# EasyEDA Pro project 滤波电路与主级放大.eprj

# Schematic Schematic1
Board Name: 滤波电路; Create Date: 2024-09-16
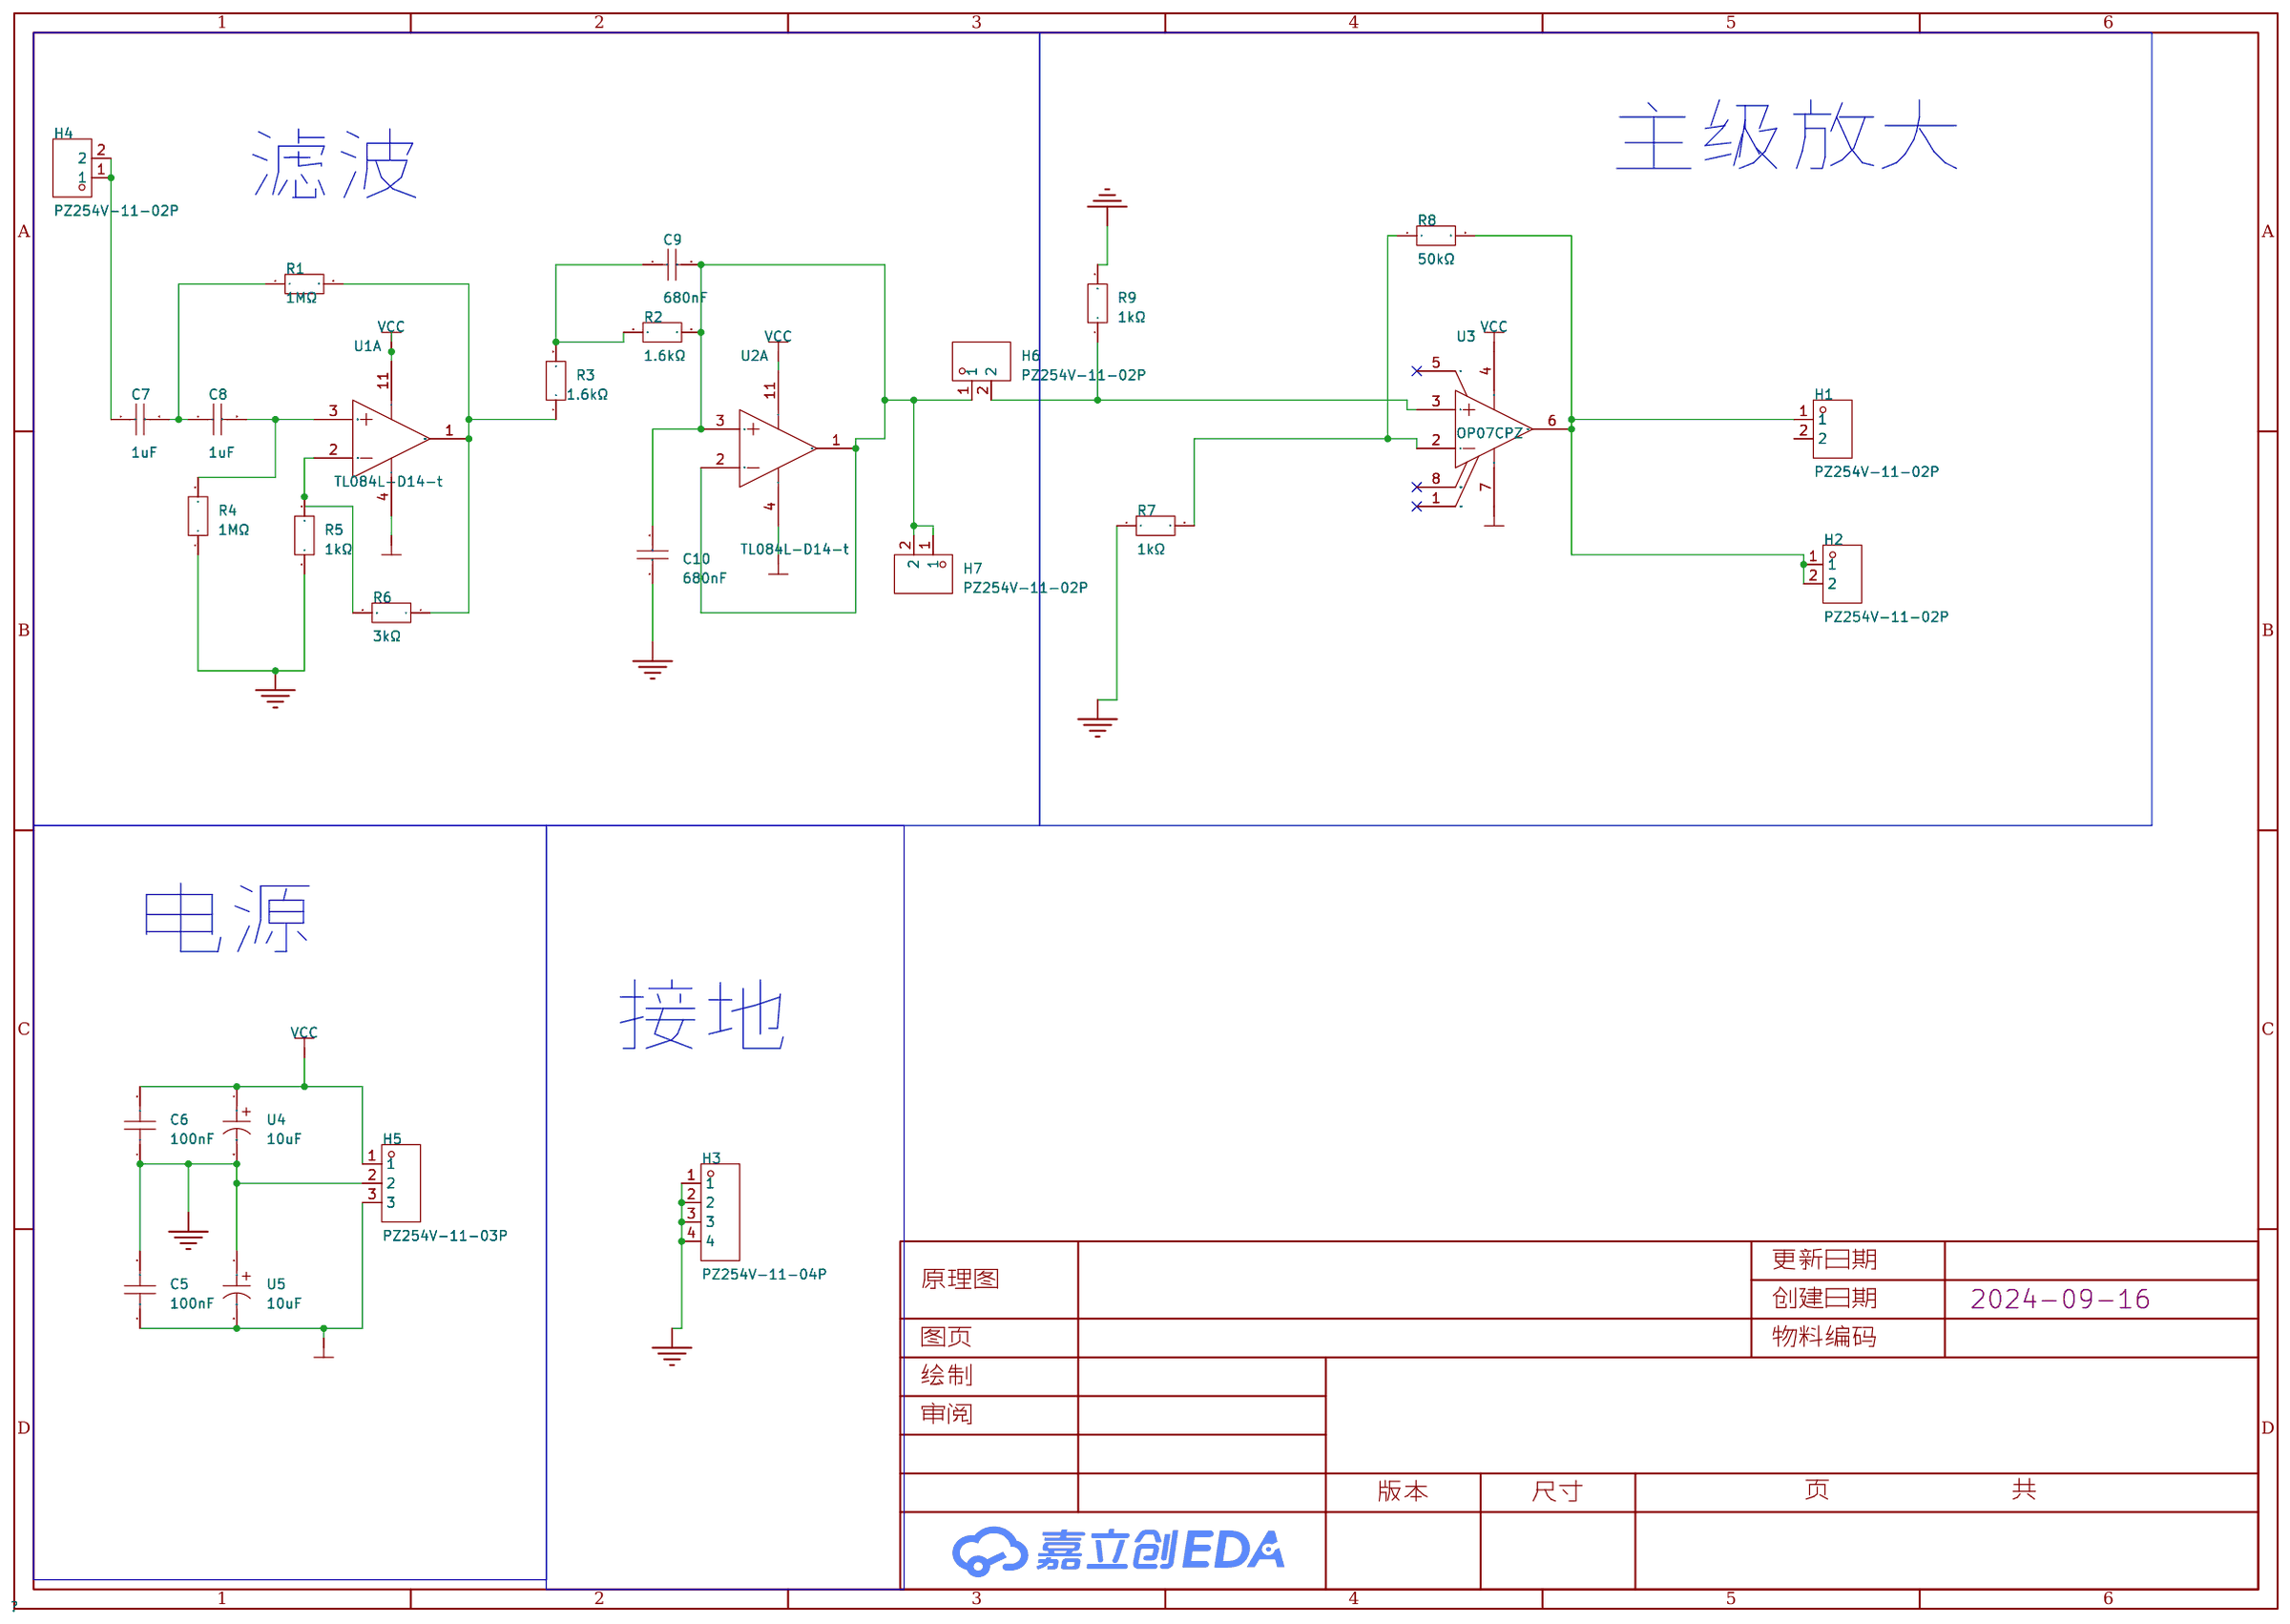
[diagram p0: schematic sheet]

## Parts
C5  100nF  [CAP-TH_L8.5-W5.0-P5.00-D1.2]
C6  100nF  [CAP-TH_L8.5-W5.0-P5.00-D1.2]
C7  1uF  [CAP-TH_L7.5-W6.5-P5.00-D0.5]
C8  1uF  [CAP-TH_L7.5-W6.5-P5.00-D0.5]
C9  680nF  [CAP-TH_L7.5-W6.5-P5.00-D0.5]
C10  680nF  [CAP-TH_L7.5-W6.5-P5.00-D0.5]
H1  PZ254V-11-02P  [HDR-TH_2P-P2.54-V-M]
H2  PZ254V-11-02P  [HDR-TH_2P-P2.54-V-M]
H3  PZ254V-11-04P  [HDR-TH_4P-P2.54-V-M]
H4  PZ254V-11-02P  [HDR-TH_2P-P2.54-V-M]
H5  PZ254V-11-03P  [HDR-TH_3P-P2.54-V-M]
H6  PZ254V-11-02P  [HDR-TH_2P-P2.54-V-M]
H7  PZ254V-11-02P  [HDR-TH_2P-P2.54-V-M]
R1  1MΩ  [RES-TH_BD2.4-L6.3-P10.30-D0.6]
R2  1.6kΩ  [RES-TH_BD2.4-L6.3-P10.30-D0.6]
R3  1.6kΩ  [RES-TH_BD2.4-L6.3-P10.30-D0.6]
R4  1MΩ  [RES-TH_BD2.4-L6.3-P10.30-D0.6]
R5  1kΩ  [RES-TH_BD2.4-L6.3-P10.30-D0.6]
R6  3kΩ  [RES-TH_BD2.4-L6.3-P10.30-D0.6]
R7  1kΩ  [RES-TH_BD2.4-L6.3-P10.30-D0.6]
R8  50kΩ  [RES-TH_BD2.4-L6.3-P10.30-D0.6]
R9  1kΩ  [RES-TH_BD2.4-L6.3-P10.30-D0.6]
U1  TL084L-D14-t  [PDIP-14_L19.3-W6.5-P2.54-LS7.6-BL]  (section 1)
U2  TL084L-D14-t  [PDIP-14_L19.3-W6.5-P2.54-LS7.6-BL]  (section 1)
U3  OP07CPZ  [PDIP-8_L9.3-W6.4-P2.54-LS7.6-BL]
U4  10uF  [CAP-TH_BD6.3-P2.50-D0.5-FD]
U5  10uF  [CAP-TH_BD6.3-P2.50-D0.5-FD]

## Library data of the parts
C5 C6 = CT4-0805B104K500F3: LCSC Part Name: 100nF ±10% 50V C3型（直脚）; Supplier Part: C84772; Manufacturer: FH(风华); Supplier Footprint: 插件,P=5.08mm; JLCPCB Part Class: 扩展库; Datasheet: https://atta.szlcsc.com/upload/public/pdf/source/20190402/C385200_059806A6312B28FF1421A2413EB641E1.pdf; Supplier: LCSC; Tolerance: ±10%; Voltage Rated: 50V; Temperature Coefficient: X7R
C7-C10 = PE684J2A0502: LCSC Part Name: 680nF ±5% 100V; Supplier Part: C478437; Manufacturer: KYET(科雅); Supplier Footprint: 插件,P=5mm; JLCPCB Part Class: 扩展库; Datasheet: https://atta.szlcsc.com/upload/public/pdf/source/20200102/C478437_80764A5A52068CAA3BEDED5BEA089104.pdf; Supplier: LCSC; Tolerance: ±5%; Voltage Rated: 100V; Operating Temperature: -40℃~+110℃
H1 H2 H4 H6 H7 = PZ254V-11-02P: LCSC Part Name: 间距:2.54mm 1x2P 直插 方针; Supplier Part: C492401; Manufacturer: XFCN(兴飞); Supplier Footprint: 插件,P=2.54mm; JLCPCB Part Class: 扩展库; Datasheet: https://atta.szlcsc.com/upload/public/pdf/source/20200309/C492401_A812433581A9B211A7FFA413ADDFF0E5.pdf; Supplier: LCSC; Pin Structure: 1x2P; Pitch: 2.54mm; Circluar Pins/Square Pins: 方针; Mounting Type: 直插; Number of Rows: 单排; Number of Pins: 2P; Length of Mating Pin: 6mm; Insulation Height: 2.5mm; Length of End Connection Pin: 3mm; Contact Material: 黄铜; Operating Temperature Range: -40℃~+105℃; Color: 黑色
H3 = PZ254V-11-04P: LCSC Part Name: 间距:2.54mm 1x4P 直插 方针; Supplier Part: C2691448; Manufacturer: XFCN(兴飞); Supplier Footprint: 插件,P=2.54mm; JLCPCB Part Class: 扩展库; Datasheet: https://atta.szlcsc.com/upload/public/pdf/source/20200309/C492403_F9F19131791D08044AD4F84F8E751A34.pdf; Supplier: LCSC; Pin Structure: 1x4P; Pitch: 2.54mm; Circluar Pins/Square Pins: 方针; Mounting Type: 直插; Number of Rows: 单排; Number of Pins: 4P; Current Rating (Max): 3A; Voltage Rating (Max): 250V; Length of Mating Pin: 6mm; Insulation Height: 2.5mm; Length of End Connection Pin: 3mm; Operating Temperature Range: -40℃~+105℃; Color: 黑色
H5 = PZ254V-11-03P: LCSC Part Name: 间距:2.54mm 1x3P 直插 方针; Supplier Part: C2937625; Manufacturer: XFCN(兴飞); Supplier Footprint: 插件,P=2.54mm; JLCPCB Part Class: 扩展库; Datasheet: https://atta.szlcsc.com/upload/public/pdf/source/20200309/C492402_8335C3D49C4E4C618838D59BB1D024C1.pdf; Supplier: LCSC; Pin Structure: 1x3P; Pitch: 2.54mm; Circluar Pins/Square Pins: 方针; Mounting Type: 直插; Number of Rows: 单排; Number of Pins: 3P; Current Rating (Max): 3A; Voltage Rating (Max): 250V; Length of Mating Pin: 6mm; Insulation Height: 2.5mm; Length of End Connection Pin: 3mm; Operating Temperature Range: -40℃~+105℃; Color: 黑色
R1-R9 = RN1/4W10KFT/BA1: LCSC Part Name: 10kΩ ±1% 250mW 金属膜电阻; Supplier Part: C410695; Manufacturer: Tyohm(幸亚电阻); Supplier Footprint: 插件,D2.4xL6.5mm; JLCPCB Part Class: 扩展库; Datasheet: https://atta.szlcsc.com/upload/public/pdf/source/20190808/C410699_D126E64D28B638F1D73B58E9F61DFD9B.pdf; Supplier: LCSC; Type: 金属膜电阻; Tolerance: ±1%; Overload Voltage (Max): 250V; Power(Watts): 250mW; Temperature Coefficient: ±50ppm/℃; Operating Temperature Range: -55℃~+125℃
U1 U2 = TL084L-D14-t: Supplier Part: C7509603; Manufacturer: UTC(友顺); Supplier Footprint: DIP-14; JLCPCB Part Class: 扩展库; Datasheet: https://atta.szlcsc.com/upload/public/pdf/source/20230825/21103CE5C41335A2FDBC1DDE797A8A69.pdf; Supplier: LCSC
U3 = OP07CPZ: Supplier Part: C408829; Manufacturer: ADI(亚德诺); Supplier Footprint: PDIP-8; JLCPCB Part Class: 扩展库; Datasheet: https://atta.szlcsc.com/upload/public/pdf/source/20190807/C408829_BE0F3A08CC30F779D7ED20D5AC7364F9.pdf; Supplier: LCSC
U4 U5 = UPM2A100MED1TD: LCSC Part Name: 10uF ±20% 100V; Supplier Part: C1580893; Manufacturer: Nichicon(尼吉康); Supplier Footprint: 插件; JLCPCB Part Class: 扩展库; Datasheet: https://atta.szlcsc.com/upload/public/pdf/source/20211202/F7FDECE0DC1B59C562DF08691C7E54B2.pdf; Supplier: LCSC; Tolerance: ±20%; Rated Voltage: 100V; Ripple Current: 104mA@10kHz; Lead Spacing: 2.5mm; φD: 6.3mm; Lifetime @ Temp: 2000hrs@105℃; Operating Temperature: -55℃~+105℃

## Nets
GND: C5.2 C6.1 C10.1 H3.1 H3.2 H3.3 H3.4 H5.2 R4.1 R5.1 R7.1 R9.2 U4.2 U5.1
VCC: C6.2 H5.1 U1.11(V-) U2.11(V-) U3.4(V-) U4.1
VDD: C5.1 H5.3 U1.4(V+) U2.4(V+) U3.7(V+) U5.2
$1N1947: C7.1 H4.1 H4.2
$1N1973: C7.2 C8.1 R1.1
$1N1977: C8.2 R4.2 U1.3(IN1+)
$1N2032: R5.2 R6.2 U1.2(IN1-)
$1N2064: R1.2 R3.1 R6.1 U1.1(OUT1)
$1N2160: C9.1 R2.1 R3.2
$1N2352: R7.2 R8.1 U3.2(IN-)
$1N2380: H1.1 H2.1 H2.2 R8.2 U3.6(OUT)
$1N3767: H6.2 R9.1 U3.3(IN+)
$1N3780: C9.2 C10.2 H6.1 H7.1 H7.2 R2.2 U2.1(OUT1) U2.2(IN1-) U2.3(IN1+)

Not connected (* = marked no-connect by the designer): H1 2; U3 1(VOS_TRIM)* 5(NC)* 8(VOS_TRIM)*

## Notes on the sheet
- 主级放大
- 滤波
- 电源
- 接地

# Board PCB1
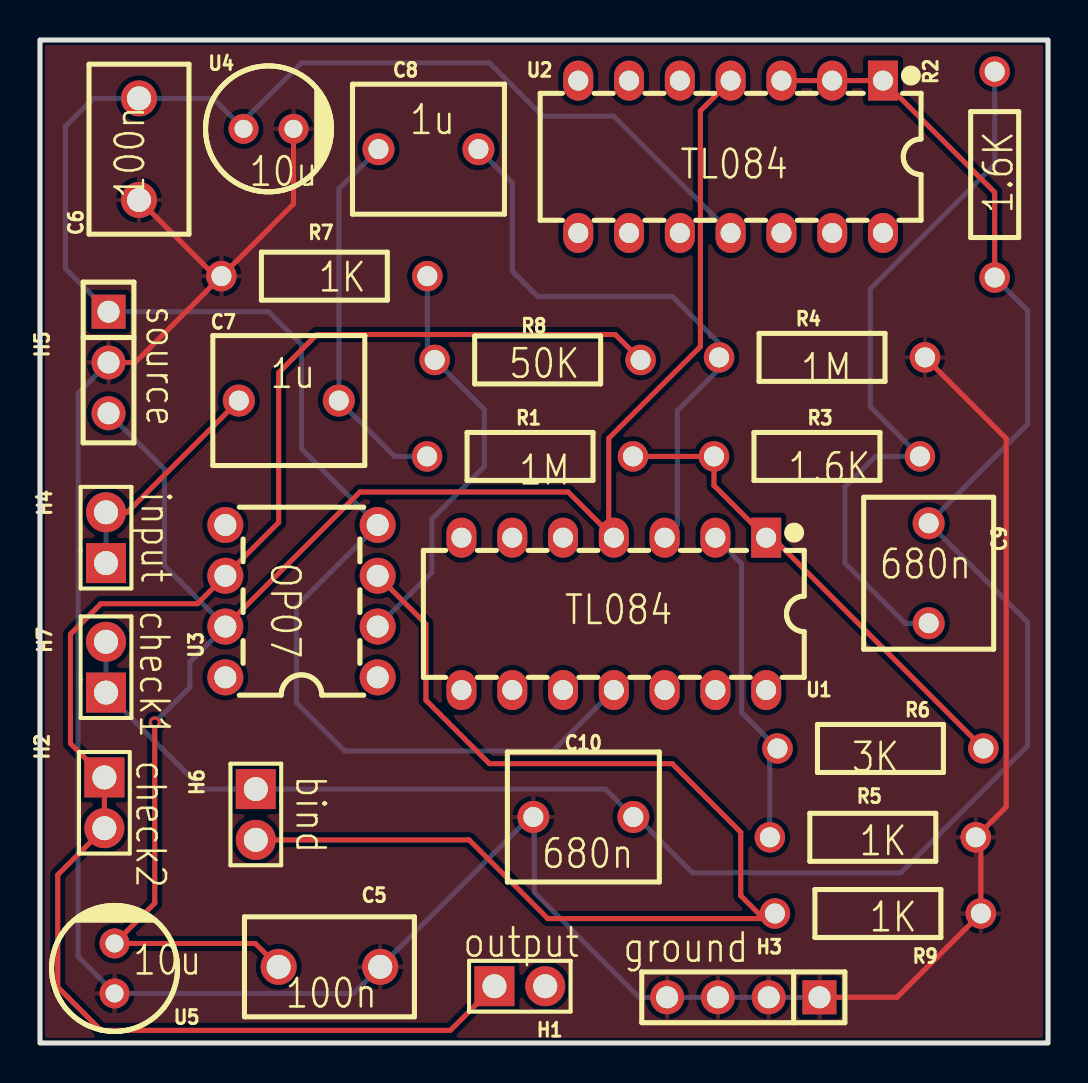
[diagram p1: board, top side]
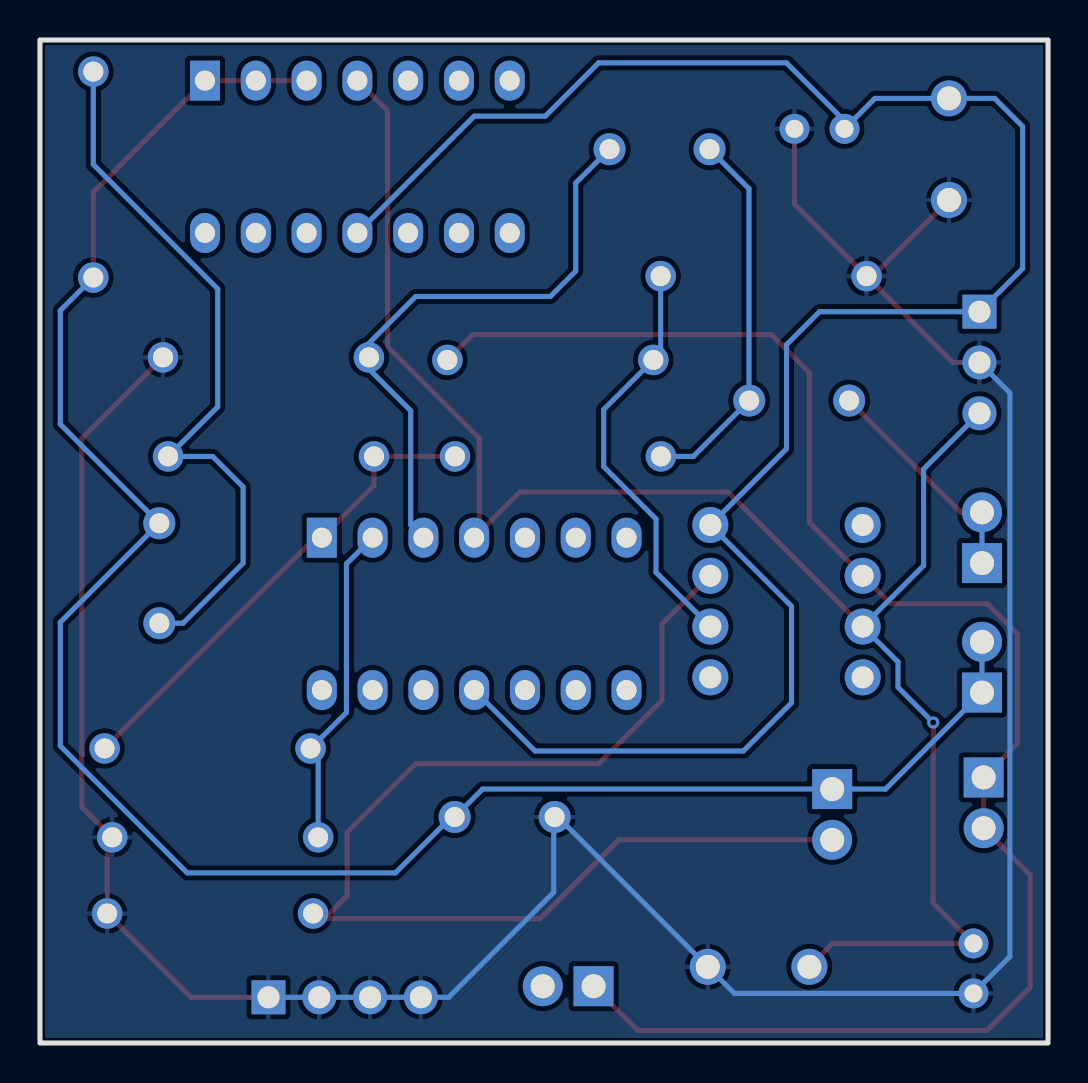
[diagram p2: board, bottom side, seen from below]

Outline 50.42 x 50.16 mm; copper layers: Top Layer, Bottom Layer. Coordinates in mm from the lower left corner of the outline.
Outline path: rectangle 0,50.16 50.42,0
Stack: Top Layer 0.035mm / Dielectric1 1.51mm FR4 er 4.5 / Bottom Layer 0.035mm

## Design rules (mm)
template: JLCPCB Capability(Two Layers Board)
spacing copperThickness1oz (default): track to track 0.102, other pairs 0.152 to 0.3
spacing copperThickness2oz: track to track 0.203, other pairs 0.152 to 0.3
track width copperThickness1oz (default): min 0.127, default 0.254, max 2.54
track width copperThickness2oz: min 0.203, default 0.254, max 2.54
differential pair differentialPair (default): width min 0.127, default 0.254, max 2.54; gap min 0.152, default 0.152
via viaSize (default): diameter min 0.5, default 0.61, max 10; hole min 0.3, default 0.305, max 6.3

## Placement (name value [footprint] x y rotation side)
C5  100nF  [CAP-TH_L8.5-W5.0-P5.00-D1.2]  14.48 3.81 0 top
C6  100nF  [CAP-TH_L8.5-W5.0-P5.00-D1.2]  4.95 44.7 90 top
C7  1uF  [CAP-TH_L7.5-W6.5-P5.00-D0.5]  12.45 32.13 0 top
C8  1uF  [CAP-TH_L7.5-W6.5-P5.00-D0.5]  19.43 44.7 0 top
C9  680nF  [CAP-TH_L7.5-W6.5-P5.00-D0.5]  44.45 23.5 90 top
C10  680nF  [CAP-TH_L7.5-W6.5-P5.00-D0.5]  27.18 11.3 0 top
H1  PZ254V-11-02P  [HDR-TH_2P-P2.54-V-M]  24 2.84 0 top
H2  PZ254V-11-02P  [HDR-TH_2P-P2.54-V-M]  3.22 12.01 270 top
H3  PZ254V-11-04P  [HDR-TH_4P-P2.54-V-M]  35.18 2.29 180 top
H4  PZ254V-11-02P  [HDR-TH_2P-P2.54-V-M]  3.3 25.27 90 top
H5  PZ254V-11-03P  [HDR-TH_3P-P2.54-V-M]  3.43 34.04 270 top
H6  PZ254V-11-02P  [HDR-TH_2P-P2.54-V-M]  10.8 11.43 270 top
H7  PZ254V-11-02P  [HDR-TH_2P-P2.54-V-M]  3.3 18.8 90 top
R1  1MΩ  [RES-TH_BD2.4-L6.3-P10.30-D0.6]  24.51 29.34 0 top
R2  1.6kΩ  [RES-TH_BD2.4-L6.3-P10.30-D0.6]  47.75 43.43 270 top
R3  1.6kΩ  [RES-TH_BD2.4-L6.3-P10.30-D0.6]  38.86 29.34 0 top
R4  1MΩ  [RES-TH_BD2.4-L6.3-P10.30-D0.6]  39.12 34.29 180 top
R5  1kΩ  [RES-TH_BD2.4-L6.3-P10.30-D0.6]  41.66 10.29 180 top
R6  3kΩ  [RES-TH_BD2.4-L6.3-P10.30-D0.6]  42.04 14.73 180 top
R7  1kΩ  [RES-TH_BD2.4-L6.3-P10.30-D0.6]  14.22 38.35 0 top
R8  50kΩ  [RES-TH_BD2.4-L6.3-P10.30-D0.6]  24.89 34.16 0 top
R9  1kΩ  [RES-TH_BD2.4-L6.3-P10.30-D0.6]  41.91 6.48 0 top
U1  TL084L-D14-t  [PDIP-14_L19.3-W6.5-P2.54-LS7.6-BL]  28.7 21.46 180 top
U2  TL084L-D14-t  [PDIP-14_L19.3-W6.5-P2.54-LS7.6-BL]  34.54 44.32 180 top
U3  OP07CPZ  [PDIP-8_L9.3-W6.4-P2.54-LS7.6-BL]  13.08 22.1 90 top
U4  10uF  [CAP-TH_BD6.3-P2.50-D0.5-FD]  11.43 45.72 0 top
U5  10uF  [CAP-TH_BD6.3-P2.50-D0.5-FD]  3.73 3.73 90 top

## Footprints (pads in the part's own frame, mm; a bottom-side part is the same pattern mirrored in y, then rotated)
CAP-TH_BD6.3-P2.50-D0.5-FD
  round 1.5 hole 0.9: 1(-1.25,0) 2(1.25,0)
CAP-TH_L7.5-W6.5-P5.00-D0.5
  round 1.6 hole 1: 1(-2.5,0) 2(2.5,0)
CAP-TH_L8.5-W5.0-P5.00-D1.2
  round 1.8 hole 1.2: 1(-2.54,0) 2(2.54,0)
HDR-TH_2P-P2.54-V-M
  rect 2x2 hole 1.2: 1(-1.27,0)
  round 2 hole 1.2: 2(1.27,0)
HDR-TH_3P-P2.54-V-M
  rect 1.7x1.7 hole 1.1: 1(-2.54,0)
  round 1.7 hole 1.1: 2(0,0) 3(2.54,0)
HDR-TH_4P-P2.54-V-M
  rect 1.7x1.7 hole 1.1: 1(-3.81,0)
  round 1.7 hole 1.1: 2(-1.27,0) 3(1.27,0) 4(3.81,0)
PDIP-8_L9.3-W6.4-P2.54-LS7.6-BL
  round 1.8 hole 1.1: 1(-3.81,-3.81) 2(-1.27,-3.81) 3(1.27,-3.81) 4(3.81,-3.81) 5(3.81,3.81) 6(1.27,3.81) 7(-1.27,3.81) 8(-3.81,3.81)
PDIP-14_L19.3-W6.5-P2.54-LS7.6-BL
  rect 1.5x2 hole 1: 1(-7.62,-3.81)
  oval 1.5x2 hole 1: 2(-5.08,-3.81) 3(-2.54,-3.81) 4(0,-3.81) 5(2.54,-3.81) 6(5.08,-3.81) 7(7.62,-3.81) 8(7.62,3.81) 9(5.08,3.81) 10(2.54,3.81) 11(0,3.81) 12(-2.54,3.81) 13(-5.08,3.81) 14(-7.62,3.81)
RES-TH_BD2.4-L6.3-P10.30-D0.6
  round 1.524 hole 1: 1(-5.15,0) 2(5.15,0)

## Nets
As in the schematic.

Pads without a net: H1 2; U1 5 6 7 8 9 10 12 13 14; U2 5 6 7 8 9 10 12 13 14; U3 1 5 8

## Via types
v1: diameter 0.61, hole 0.305, Top Layer to Bottom Layer, 1 via

## Routing (per net, layer and track width the routed paths; a pad name or vN(x,y) marks a point on that pad's centre or on a via; arc(x,y) is an arc through that point)
GND: length 139.8
  Top Layer w0.254: R7.1 4.76,34.04 H5.2 ; R7.1 12.68,41.96 U4.2 ; R7.1 8.76,38.35 C6.1 ; H3.1 42.87,2.29 R9.2 47.06,10.03 R5.1 48.33,11.81 48.33,30.23 R4.1
  Bottom Layer w0.254: 3.75,2.48 U5.1 ; 3.75,2.48 1.91,4.32 1.91,32.51 H5.2 ; 3.75,2.48 15.69,2.48 C5.2 24.47,11.26 24.72,11.26 ; H3.1 H3.2 H3.3 H3.4 29.97,2.29 24.72,7.53 24.72,11.26 ; 24.72,11.26 C10.1
VCC: length 99.4
  Bottom Layer w0.254: U2.11 28.7,46.36 25.15,46.36 22.48,49.02 13.08,49.02 10.18,46.12 U4.1 8.66,47.24 C6.2 2.67,47.24 1.27,45.85 1.27,38.73 H5.1 11.43,36.58 13.08,34.92 13.08,29.72 U3.4 12.83,21.84 12.83,17.02 15.24,14.61 25.65,14.61 U1.11
VDD: length 88.2
  Top Layer w0.254: 28.45,25.53 28.45,30.24 33.03,34.83 33.03,46.62 U2.4 ; 28.45,25.53 U1.4 ; 28.45,25.53 26.42,27.56 16,27.56 U3.7 ; C5.1 10.77,4.98 U5.2 5.74,6.99 v1(5.74,16.03)
  Bottom Layer w0.254: H5.3 6.22,28.7 6.22,23.88 U3.7 7.5,19.06 7.5,17.79 v1(5.74,16.03)
$1N1947: length 11.5
  Top Layer w0.254: H4.2 4.36,26.54 C7.1
  Bottom Layer w0.254: H4.1 H4.2
$1N1973: length 19
  Bottom Layer w0.254: R1.1 17.74,29.34 14.96,32.12 ; 14.96,32.12 C7.2 ; 14.96,32.12 14.96,42.73 C8.1
$1N1977: length 29.5
  Bottom Layer w0.254: C8.2 23.62,43.01 23.62,38.61 24.89,37.34 31.62,37.34 33.97,35 R4.2 33.97,33.71 31.88,31.62 31.88,25.91 U1.3
$1N2032: length 16.4
  Bottom Layer w0.254: U1.2 35.09,23.96 35.09,16.53 R6.2 36.51,14.35 R5.2
$1N2064: length 24.4
  Top Layer w0.254: R6.1 36.65,25.27 U1.1 33.71,27.88 33.71,29.34 R1.2
$1N2160: length 36.5
  Bottom Layer w0.254: C9.1 43.27,21 40.26,24 40.26,27.81 41.78,29.34 R3.2 41.53,31.82 41.53,37.72 47.75,43.94 R2.1
$1N2352: length 20.9
  Bottom Layer w0.254: 19.37,38.35 19.37,34.53 R8.1 22.22,31.68 22.22,28.83 19.61,26.21 19.61,23.54 U3.2
$1N2380: length 82.6
  Top Layer w0.254: H1.1 20.53,0.63 3.05,0.63 0.89,2.79 0.89,8.41 H2.2 H2.1 1.52,14.98 1.52,20.45 3.05,21.97 7.87,21.97 U3.6 11.94,26.03 11.94,33.53 13.84,35.43 28.77,35.43 R8.2
$1N3767: length 58.7
  Top Layer w0.254: H6.2 21.46,10.16 25.4,6.22 36.51,6.22 36.76,6.48 35.94,6.48 35.05,7.37 35.05,10.54 31.62,13.97 22.48,13.97 19.3,17.14 19.3,20.95 U3.3
$1N3780: length 100.5
  Top Layer w0.254: U2.3 U2.2 U2.1 47.75,42.55 R2.2
  Bottom Layer w0.254: H7.2 H7.1 8.13,12.7 H6.1 28.28,12.7 C10.2 29.84,11.3 32.64,8.51 43.05,8.51 49.4,14.86 49.4,21.04 C9.2 49.4,30.95 49.4,36.63 R2.2

## Copper pours and planes (outline as drawn; the poured copper is in the pictures)
GND on Top Layer: 0.13,50.38 50.55,50.38 50.55,0 0.13,0
GND on Top Layer: 0.22,50.16 50.42,50.16 50.42,0 0.22,0
GND on Bottom Layer: 0,50.16 50.68,50.16 50.68,0 0,0
GND on Bottom Layer: 0,50.16 50.42,50.16 50.42,0 0,0

## Text on the board
Top Silkscreen Layer: 10u | 1u | 100n | 1K | output | 1M | TL084 | ground | 1.6K | 3K | check2 | check1 | input | source | OP07 | bind | 50K | 680n
